# Altium schematic sheet 0129_EC_MEC1521_1.SchDoc
size A3
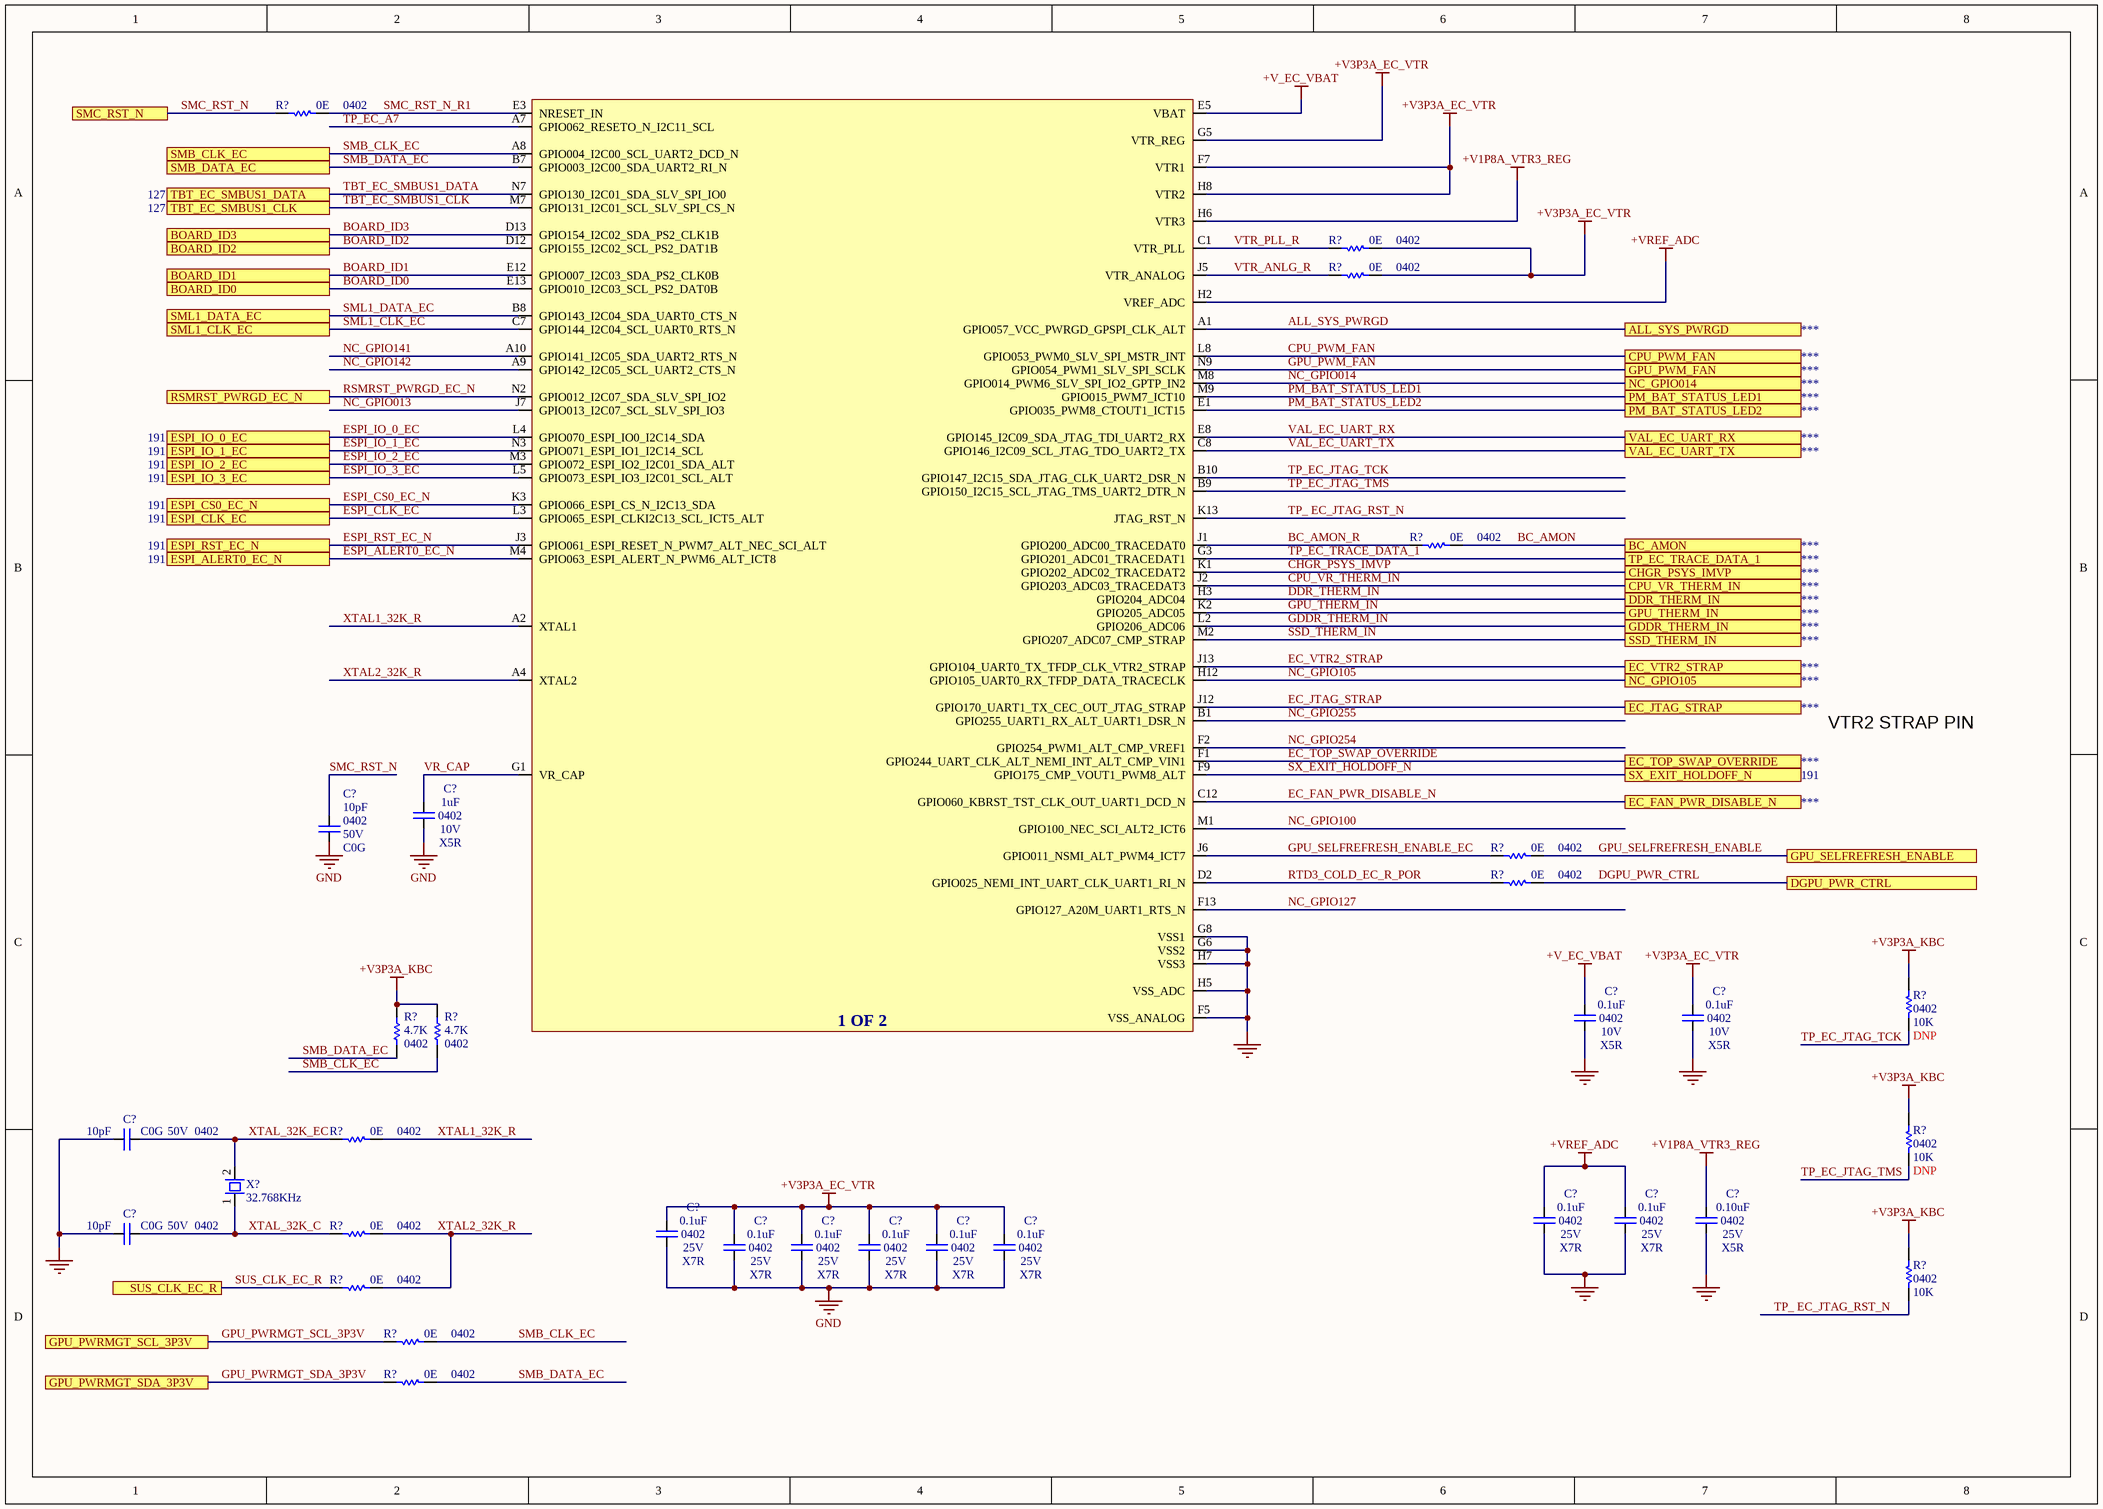
[diagram p0: 0129_EC_MEC1521_1.SchDoc]

## Parts
(Parts that share a designator on the sheet are numbered #1, #2 ... from top to bottom, then left to right.)
C?#1  value 1uF  Case/Package: 0402  Voltage: 10V  Dielectric: X5R  [CAPC0402]
C?#2  value 10pF  Case/Package: 0402  Voltage: 50V  Dielectric: C0G  [capc0402]
C?#3  value 0.1uF  Case/Package: 0402  Voltage: 10V  Dielectric: X5R  [CAPC0402]
C?#4  value 0.1uF  Case/Package: 0402  Voltage: 10V  Dielectric: X5R  [CAPC0402]
C?#5  value 10pF  Case/Package: 0402  Voltage: 50V  Dielectric: C0G  [capc0402]
C?#6  value 0.1uF  Case/Package: 0402  Voltage: 25V  Dielectric: X7R  [CAPC0402]
C?#7  value 0.1uF  Case/Package: 0402  Voltage: 25V  Dielectric: X7R  [CAPC0402]
C?#8  value 0.10uF  Case/Package: 0402  Voltage: 25V  Dielectric: X5R  [CAPC0402]
C?#9  value 10pF  Case/Package: 0402  Voltage: 50V  Dielectric: C0G  [capc0402]
C?#10  value 0.1uF  Case/Package: 0402  Voltage: 25V  Dielectric: X7R  [CAPC0402]
C?#11  value 0.1uF  Case/Package: 0402  Voltage: 25V  Dielectric: X7R  [CAPC0402]
C?#12  value 0.1uF  Case/Package: 0402  Voltage: 25V  Dielectric: X7R  [CAPC0402]
C?#13  value 0.1uF  Case/Package: 0402  Voltage: 25V  Dielectric: X7R  [CAPC0402]
C?#14  value 0.1uF  Case/Package: 0402  Voltage: 25V  Dielectric: X7R  [CAPC0402]
C?#15  value 0.1uF  Case/Package: 0402  Voltage: 25V  Dielectric: X7R  [CAPC0402]
R?#1  value 0E  Case/Package: 0402  [RESC0402]  (hidden comment: Res)
R?#2  value 0E  Case/Package: 0402  [RESC0402]  (hidden comment: Res)
R?#3  value 0E  Case/Package: 0402  [RESC0402]  (hidden comment: Res)
R?#4  value 0E  Case/Package: 0402  [RESC0402]  (hidden comment: Res)
R?#5  value 0E  Case/Package: 0402  [RESC0402]  (hidden comment: Res)
R?#6  value 0E  Case/Package: 0402  [RESC0402]  (hidden comment: Res)
R?#7  value 10K  Case/Package: 0402  [RESC0402]  (hidden comment: Res)
R?#8  value 4.7K  Case/Package: 0402  [RESC0402]  (hidden comment: Res)
R?#9  value 4.7K  Case/Package: 0402  [RESC0402]  (hidden comment: Res)
R?#10  value 0E  Case/Package: 0402  [RESC0402]  (hidden comment: Res)
R?#11  value 10K  Case/Package: 0402  [RESC0402]  (hidden comment: Res)
R?#12  value 0E  Case/Package: 0402  [RESC0402]  (hidden comment: Res)
R?#13  value 10K  Case/Package: 0402  [RESC0402]  (hidden comment: Res)
R?#14  value 0E  Case/Package: 0402  [RESC0402]  (hidden comment: Res)
R?#15  value 0E  Case/Package: 0402  [RESC0402]  (hidden comment: Res)
R?#16  value 0E  Case/Package: 0402  [RESC0402]  (hidden comment: Res)
U?  MEC152X_2  (value not drawn)  (part A of 2)
X?  32.768KHz  [9HT1232768KDZFT]

## Ports
ALL_SYS_PWRGD, BC_AMON, BOARD_ID0, BOARD_ID1, BOARD_ID2, BOARD_ID3, CHGR_PSYS_IMVP, CPU_PWM_FAN, CPU_VR_THERM_IN, DDR_THERM_IN, DGPU_PWR_CTRL, EC_FAN_PWR_DISABLE_N, EC_JTAG_STRAP, EC_TOP_SWAP_OVERRIDE, EC_VTR2_STRAP, ESPI_ALERT0_EC_N, ESPI_CLK_EC, ESPI_CS0_EC_N, ESPI_IO_0_EC, ESPI_IO_1_EC, ESPI_IO_2_EC, ESPI_IO_3_EC, ESPI_RST_EC_N, GDDR_THERM_IN, GPU_PWM_FAN, GPU_PWRMGT_SCL_3P3V, GPU_PWRMGT_SDA_3P3V, GPU_SELFREFRESH_ENABLE, GPU_THERM_IN, NC_GPIO014, NC_GPIO105, PM_BAT_STATUS_LED1, PM_BAT_STATUS_LED2, RSMRST_PWRGD_EC_N, SMB_CLK_EC, SMB_DATA_EC, SMC_RST_N, SML1_CLK_EC, SML1_DATA_EC, SSD_THERM_IN, SUS_CLK_EC_R, SX_EXIT_HOLDOFF_N, TBT_EC_SMBUS1_CLK, TBT_EC_SMBUS1_DATA, TP_EC_TRACE_DATA_1, VAL_EC_UART_RX, VAL_EC_UART_TX

## Nets
+V1P8A_VTR3_REG: C?#8.2 U?.H6(VTR3)
+V3P3A_EC_VTR: C?#4.2 C?#10.2 C?#11.2 C?#12.2 C?#13.2 C?#14.2 C?#15.2 R?#2.2 R?#3.2 U?.F7(VTR1) U?.G5(VTR_REG) U?.H8(VTR2)
+V3P3A_KBC: R?#7.1 R?#8.2 R?#9.2 R?#11.1 R?#13.1
+V_EC_VBAT: C?#3.2 U?.E5(VBAT)
+VREF_ADC: C?#6.2 C?#7.2 U?.H2(VREF_ADC)
GND: C?#1.1 C?#2.2 C?#3.1 C?#4.1 C?#5.1 C?#6.1 C?#7.1 C?#8.1 C?#9.1 C?#10.1 C?#11.1 C?#12.1 C?#13.1 C?#14.1 C?#15.1 U?.F5(VSS_ANALOG) U?.G6(VSS2) U?.G8(VSS1) U?.H5(VSS_ADC) U?.H7(VSS3)
VBAT: U?.E5(VBAT)
VR_CAP: C?#1.2 U?.G1(VR_CAP)
VREF_ADC: U?.H2(VREF_ADC)
VTR1: U?.F7(VTR1)
VTR2: U?.H8(VTR2)
VTR3: U?.H6(VTR3)
VTR_ANALOG: U?.J5(VTR_ANALOG)
VTR_PLL: U?.C1(VTR_PLL)
VTR_REG: U?.G5(VTR_REG)
ALL_SYS_PWRGD: U?.A1(GPIO057_VCC_PWRGD_GPSPI_CLK_ALT) ; port ALL_SYS_PWRGD
BC_AMON: R?#4.2 ; port BC_AMON
BC_AMON_R: R?#4.1 U?.J1(GPIO200_ADC00_TRACEDAT0)
BOARD_ID0: U?.E13(GPIO010_I2C03_SCL_PS2_DAT0B) ; port BOARD_ID0
BOARD_ID1: U?.E12(GPIO007_I2C03_SDA_PS2_CLK0B) ; port BOARD_ID1
BOARD_ID2: U?.D12(GPIO155_I2C02_SCL_PS2_DAT1B) ; port BOARD_ID2
BOARD_ID3: U?.D13(GPIO154_I2C02_SDA_PS2_CLK1B) ; port BOARD_ID3
CHGR_PSYS_IMVP: U?.K1(GPIO202_ADC02_TRACEDAT2) ; port CHGR_PSYS_IMVP
CPU_PWM_FAN: U?.L8(GPIO053_PWM0_SLV_SPI_MSTR_INT) ; port CPU_PWM_FAN
CPU_VR_THERM_IN: U?.J2(GPIO203_ADC03_TRACEDAT3) ; port CPU_VR_THERM_IN
DDR_THERM_IN: U?.H3(GPIO204_ADC04) ; port DDR_THERM_IN
DGPU_PWR_CTRL: R?#6.2 ; port DGPU_PWR_CTRL
EC_FAN_PWR_DISABLE_N: U?.C12(GPIO060_KBRST_TST_CLK_OUT_UART1_DCD_N) ; port EC_FAN_PWR_DISABLE_N
EC_JTAG_STRAP: U?.J12(GPIO170_UART1_TX_CEC_OUT_JTAG_STRAP) ; port EC_JTAG_STRAP
EC_TOP_SWAP_OVERRIDE: U?.F1(GPIO244_UART_CLK_ALT_NEMI_INT_ALT_CMP_VIN1) ; port EC_TOP_SWAP_OVERRIDE
EC_VTR2_STRAP: U?.J13(GPIO104_UART0_TX_TFDP_CLK_VTR2_STRAP) ; port EC_VTR2_STRAP
ESPI_ALERT0_EC_N: U?.M4(GPIO063_ESPI_ALERT_N_PWM6_ALT_ICT8) ; port ESPI_ALERT0_EC_N
ESPI_CLK_EC: U?.L3(GPIO065_ESPI_CLKI2C13_SCL_ICT5_ALT) ; port ESPI_CLK_EC
ESPI_CS0_EC_N: U?.K3(GPIO066_ESPI_CS_N_I2C13_SDA) ; port ESPI_CS0_EC_N
ESPI_IO_0_EC: U?.L4(GPIO070_ESPI_IO0_I2C14_SDA) ; port ESPI_IO_0_EC
ESPI_IO_1_EC: U?.N3(GPIO071_ESPI_IO1_I2C14_SCL) ; port ESPI_IO_1_EC
ESPI_IO_2_EC: U?.M3(GPIO072_ESPI_IO2_I2C01_SDA_ALT) ; port ESPI_IO_2_EC
ESPI_IO_3_EC: U?.L5(GPIO073_ESPI_IO3_I2C01_SCL_ALT) ; port ESPI_IO_3_EC
ESPI_RST_EC_N: U?.J3(GPIO061_ESPI_RESET_N_PWM7_ALT_NEC_SCI_ALT) ; port ESPI_RST_EC_N
GDDR_THERM_IN: U?.L2(GPIO206_ADC06) ; port GDDR_THERM_IN
GPU_PWM_FAN: U?.N9(GPIO054_PWM1_SLV_SPI_SCLK) ; port GPU_PWM_FAN
GPU_PWRMGT_SCL_3P3V: R?#15.1 ; port GPU_PWRMGT_SCL_3P3V
GPU_PWRMGT_SDA_3P3V: R?#16.1 ; port GPU_PWRMGT_SDA_3P3V
GPU_SELFREFRESH_ENABLE: R?#5.2 ; port GPU_SELFREFRESH_ENABLE
GPU_SELFREFRESH_ENABLE_EC: R?#5.1 U?.J6(GPIO011_NSMI_ALT_PWM4_ICT7)
GPU_THERM_IN: U?.K2(GPIO205_ADC05) ; port GPU_THERM_IN
NC_GPIO013: U?.J7(GPIO013_I2C07_SCL_SLV_SPI_IO3)
NC_GPIO014: U?.M8(GPIO014_PWM6_SLV_SPI_IO2_GPTP_IN2) ; port NC_GPIO014
NC_GPIO100: U?.M1(GPIO100_NEC_SCI_ALT2_ICT6)
NC_GPIO105: U?.H12(GPIO105_UART0_RX_TFDP_DATA_TRACECLK) ; port NC_GPIO105
NC_GPIO127: U?.F13(GPIO127_A20M_UART1_RTS_N)
NC_GPIO141: U?.A10(GPIO141_I2C05_SDA_UART2_RTS_N)
NC_GPIO142: U?.A9(GPIO142_I2C05_SCL_UART2_CTS_N)
NC_GPIO254: U?.F2(GPIO254_PWM1_ALT_CMP_VREF1)
NC_GPIO255: U?.B1(GPIO255_UART1_RX_ALT_UART1_DSR_N)
PM_BAT_STATUS_LED1: U?.M9(GPIO015_PWM7_ICT10) ; port PM_BAT_STATUS_LED1
PM_BAT_STATUS_LED2: U?.E1(GPIO035_PWM8_CTOUT1_ICT15) ; port PM_BAT_STATUS_LED2
RSMRST_PWRGD_EC_N: U?.N2(GPIO012_I2C07_SDA_SLV_SPI_IO2) ; port RSMRST_PWRGD_EC_N
RTD3_COLD_EC_R_POR: R?#6.1 U?.D2(GPIO025_NEMI_INT_UART_CLK_UART1_RI_N)
SMB_CLK_EC: R?#9.1 R?#15.2 U?.A8(GPIO004_I2C00_SCL_UART2_DCD_N) ; port SMB_CLK_EC
SMB_DATA_EC: R?#8.1 R?#16.2 U?.B7(GPIO003_I2C00_SDA_UART2_RI_N) ; port SMB_DATA_EC
SMC_RST_N: C?#2.1 R?#1.1 ; port SMC_RST_N
SMC_RST_N_R1: R?#1.2 U?.E3(NRESET_IN)
SML1_CLK_EC: U?.C7(GPIO144_I2C04_SCL_UART0_RTS_N) ; port SML1_CLK_EC
SML1_DATA_EC: U?.B8(GPIO143_I2C04_SDA_UART0_CTS_N) ; port SML1_DATA_EC
SSD_THERM_IN: U?.M2(GPIO207_ADC07_CMP_STRAP) ; port SSD_THERM_IN
SUS_CLK_EC_R: R?#14.1 ; port SUS_CLK_EC_R
SX_EXIT_HOLDOFF_N: U?.F9(GPIO175_CMP_VOUT1_PWM8_ALT) ; port SX_EXIT_HOLDOFF_N
TBT_EC_SMBUS1_CLK: U?.M7(GPIO131_I2C01_SCL_SLV_SPI_CS_N) ; port TBT_EC_SMBUS1_CLK
TBT_EC_SMBUS1_DATA: U?.N7(GPIO130_I2C01_SDA_SLV_SPI_IO0) ; port TBT_EC_SMBUS1_DATA
TP_ EC_JTAG_RST_N: R?#13.2 U?.K13(JTAG_RST_N)
TP_EC_A7: U?.A7(GPIO062_RESETO_N_I2C11_SCL)
TP_EC_JTAG_TCK: R?#7.2 U?.B10(GPIO147_I2C15_SDA_JTAG_CLK_UART2_DSR_N)
TP_EC_JTAG_TMS: R?#11.2 U?.B9(GPIO150_I2C15_SCL_JTAG_TMS_UART2_DTR_N)
TP_EC_TRACE_DATA_1: U?.G3(GPIO201_ADC01_TRACEDAT1) ; port TP_EC_TRACE_DATA_1
VAL_EC_UART_RX: U?.E8(GPIO145_I2C09_SDA_JTAG_TDI_UART2_RX) ; port VAL_EC_UART_RX
VAL_EC_UART_TX: U?.C8(GPIO146_I2C09_SCL_JTAG_TDO_UART2_TX) ; port VAL_EC_UART_TX
VTR_ANLG_R: R?#3.1 U?.J5(VTR_ANALOG)
VTR_PLL_R: R?#2.1 U?.C1(VTR_PLL)
XTAL1_32K_R: R?#10.2 U?.A2(XTAL1)
XTAL2_32K_R: R?#12.2 R?#14.2 U?.A4(XTAL2)
XTAL_32K_C: C?#9.2 R?#12.1 X?.1(CRYSTAL_1)
XTAL_32K_EC: C?#5.2 R?#10.1 X?.2(CRYSTAL_2)

## Notes on the sheet
- VTR2 STRAP PIN
- (in symbol MEC152X_2, part A) 1 OF 2

## Library data of the parts
C?#1 = Cap: CAP CER 1uF 10V X5R 0402
C?#2 C?#5 C?#9 = Cap: CAP CER 10pF 50V C0G 0402
C?#3 = Cap: CAP CER 0.1uF 10V X7R 0402
C?#4 = Cap: CAP CER 0.1uF 10V X5R 0402
C?#6 C?#7 C?#10-C?#15 = Cap: CAP CER 0.1uF 25V X7R 0402
C?#8 = Cap: CAP CER 0.10uF 25V X5R 0402
R?#1-R?#6 R?#10 R?#12 R?#14-R?#16 = Res: Thick Film Resistor -  0ohm, 1%, 0402
R?#7 R?#11 R?#13 = Res: Thick Film Resistor -  10Kohm, 1%, 0402
  R?#7 R?#11: DNP: DNP
R?#8 R?#9 = Res: Thick Film Resistor -  4.7Kohm, 1%, 0402
X? = Crystal 32.768K DZF-T: Crystals 32.768KHz 20ppm 12.5pF; Manufacturer_Part_Number: 9HT12-32.768KDZF-T; Value: 32.768KHz; Case/Package: SMD/SMT
U? = MEC152X_2: Case/Package: *; Manufacturer Part Number: *